# Altium schematic sheet 00-FOC_DriveBoard.SchDoc
size A4
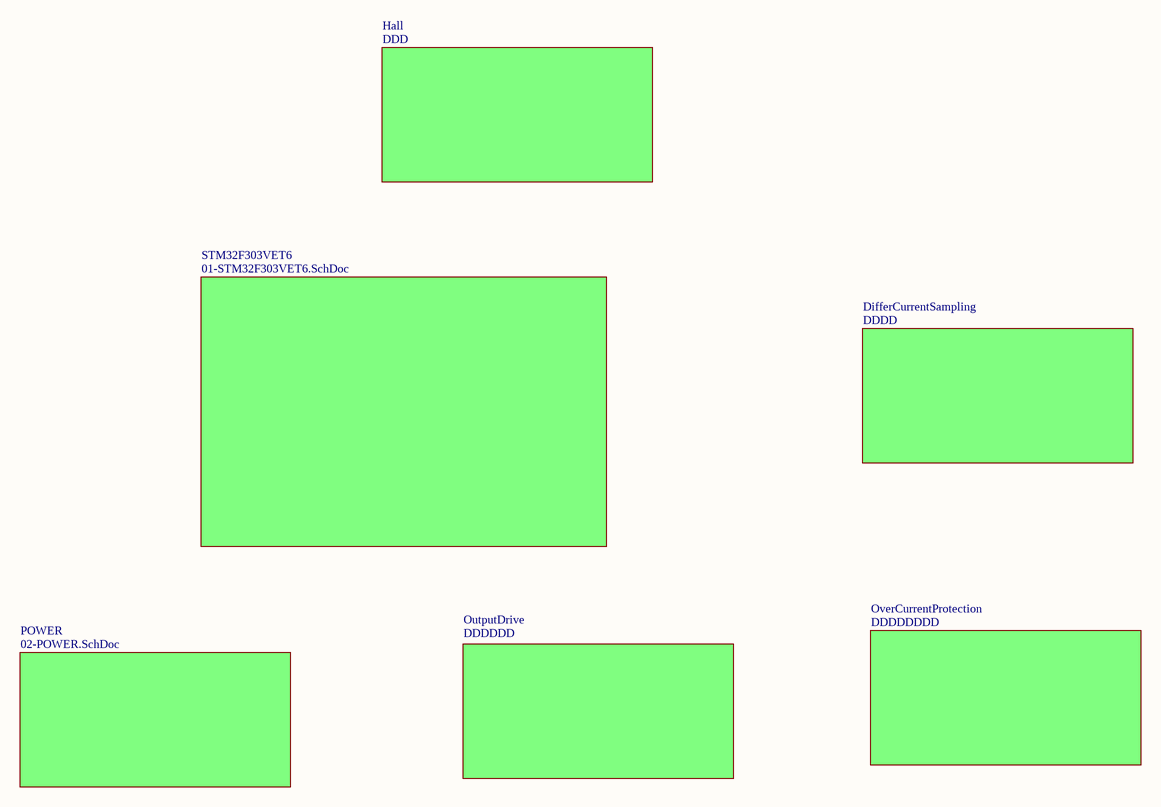
[diagram p0: 00-FOC_DriveBoard.SchDoc]

## Sub-sheets
DifferCurrentSampling = DDDD: no entries
Hall = DDD: no entries
OutputDrive = DDDDDD: no entries
OverCurrentProtection = DDDDDDDD: no entries
POWER = 02-POWER.SchDoc: no entries
STM32F303VET6 = 01-STM32F303VET6.SchDoc: no entries